# Altium schematic sheet Sheet1.SchDoc
size 431 x 279 mm; SheetNumber: 1; SheetTotal: 1; ENG_APP_DATE: --/--/--; DSN_APP_DATE: --/--/--; CHK_APP_DATE: --/--/--
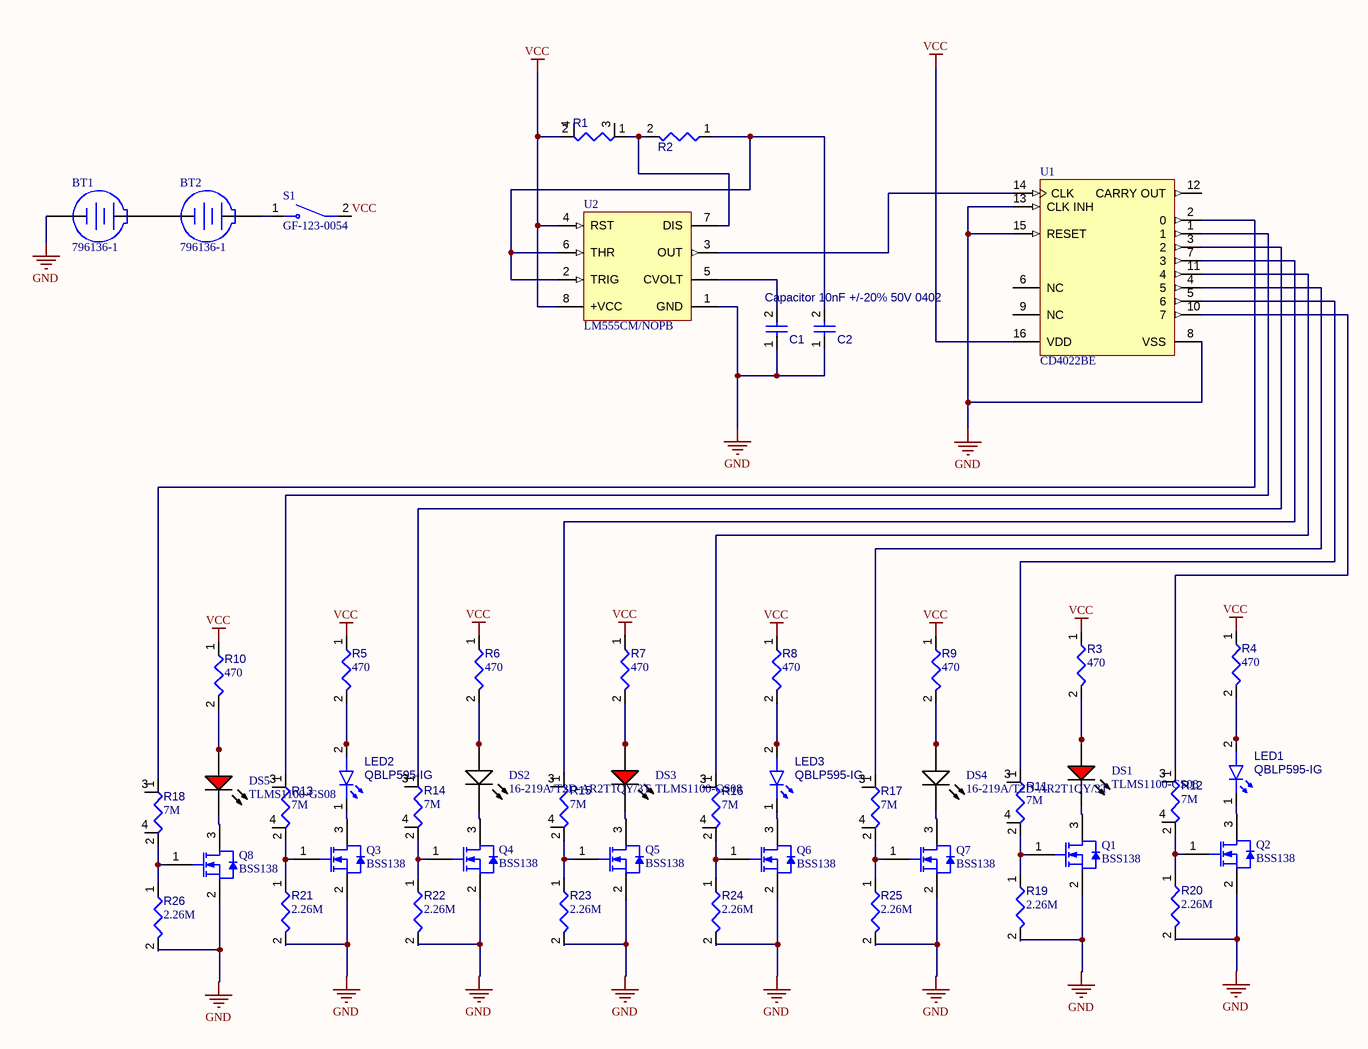
[diagram p0: Sheet1.SchDoc]

## Parts
BT1  796136-1  [TECO-796136-1_V]
BT2  796136-1  [TECO-796136-1_V]
C1  Capacitor 10nF +/-20% 50V 0402  [CAPC0402(1005)60_L]
C2  Capacitor 100 nF +/-10% 50 V 0805  [CAPC2013X95X50LL10T25]  (value not drawn)
DS1  TLMS1100-GS08  [VISH-TLMX1100_V]
DS2  16-219A/T2D-AR2T1QY/3T  [EVRL-0402-2_V]
DS3  TLMS1100-GS08  [VISH-TLMX1100_V]
DS4  16-219A/T2D-AR2T1QY/3T  [EVRL-0402-2_V]
DS5  TLMS1100-GS08  [VISH-TLMX1100_V]
LED1  QBLP595-IG  [QTB-QBLP595_V]
LED2  QBLP595-IG  [QTB-QBLP595_V]
LED3  QBLP595-IG  [QTB-QBLP595_V]
Q1  BSS138  [FAIR-SOT23-3_V]
Q2  BSS138  [FAIR-SOT23-3_V]
Q3  BSS138  [FAIR-SOT23-3_V]
Q4  BSS138  [FAIR-SOT23-3_V]
Q5  BSS138  [FAIR-SOT23-3_V]
Q6  BSS138  [FAIR-SOT23-3_V]
Q7  BSS138  [FAIR-SOT23-3_V]
Q8  BSS138  [FAIR-SOT23-3_V]
R1  KRL3216T4A-M-R007-F-T1  [SUSUMU-3216T4A]  (value not drawn)
R2  Resistor 1M +/-1 % 0402 63 mW  [RESC0402(1005)_L]  (value not drawn)
R3  value 470  [RESC0805(2012)_L]  (hidden comment: Resistor 470R +/-5% 0805 125 mW)
R4  value 470  [RESC0805(2012)_L]  (hidden comment: Resistor 470R +/-5% 0805 125 mW)
R5  value 470  [RESC0805(2012)_L]  (hidden comment: Resistor 470R +/-5% 0805 125 mW)
R6  value 470  [RESC0805(2012)_L]  (hidden comment: Resistor 470R +/-5% 0805 125 mW)
R7  value 470  [RESC0805(2012)_L]  (hidden comment: Resistor 470R +/-5% 0805 125 mW)
R8  value 470  [RESC0805(2012)_L]  (hidden comment: Resistor 470R +/-5% 0805 125 mW)
R9  value 470  [RESC0805(2012)_L]  (hidden comment: Resistor 470R +/-5% 0805 125 mW)
R10  value 470  [RESC0805(2012)_L]  (hidden comment: Resistor 470R +/-5% 0805 125 mW)
R11  value 7M  [SUSUMU-3216T4A]  (hidden comment: KRL3216T4A-M-R007-F-T1)
R12  value 7M  [SUSUMU-3216T4A]  (hidden comment: KRL3216T4A-M-R007-F-T1)
R13  value 7M  [SUSUMU-3216T4A]  (hidden comment: KRL3216T4A-M-R007-F-T1)
R14  value 7M  [SUSUMU-3216T4A]  (hidden comment: KRL3216T4A-M-R007-F-T1)
R15  value 7M  [SUSUMU-3216T4A]  (hidden comment: KRL3216T4A-M-R007-F-T1)
R16  value 7M  [SUSUMU-3216T4A]  (hidden comment: KRL3216T4A-M-R007-F-T1)
R17  value 7M  [SUSUMU-3216T4A]  (hidden comment: KRL3216T4A-M-R007-F-T1)
R18  value 7M  [SUSUMU-3216T4A]  (hidden comment: KRL3216T4A-M-R007-F-T1)
R19  value 2.26M  [RESC0402(1005)_L]  (hidden comment: 2D26MR2F)
R20  value 2.26M  [RESC0402(1005)_L]  (hidden comment: 2D26MR2F)
R21  value 2.26M  [RESC0402(1005)_L]  (hidden comment: 2D26MR2F)
R22  value 2.26M  [RESC0402(1005)_L]  (hidden comment: 2D26MR2F)
R23  value 2.26M  [RESC0402(1005)_L]  (hidden comment: 2D26MR2F)
R24  value 2.26M  [RESC0402(1005)_L]  (hidden comment: 2D26MR2F)
R25  value 2.26M  [RESC0402(1005)_L]  (hidden comment: 2D26MR2F)
R26  value 2.26M  [RESC0402(1005)_L]  (hidden comment: 2D26MR2F)
S1  GF-123-0054  [SW_GF-123-0054]
U1  CD4022BE  [N0016A]
U2  LM555CM/NOPB  [D0008A_M]

## Nets
GND: BT1.2(-) C1.1 C2.1 Q1.2(S) Q2.2(S) Q3.2(S) Q4.2(S) Q5.2(S) Q6.2(S) Q7.2(S) Q8.2(S) R19.2 R20.2 R21.2 R22.2 R23.2 R24.2 R25.2 R26.2 U1.8(VSS) U1.13(CLK_INH) U1.15(RESET) U2.1(GND)
VCC: R1.2(I2) R3.1 R4.1 R5.1 R6.1 R7.1 R8.1 R9.1 R10.1 S1.2 U1.16(VDD) U2.4(RST) U2.8(+VCC)
NetBT1_1: BT1.1(+) BT2.2(-)
NetBT2_1: BT2.1(+) S1.1
NetC1_2: C1.2 U2.5(CVOLT)
NetC2_2: C2.2 R2.1 U2.2(TRIG) U2.6(THR)
NetDS1_1: DS1.1(A) R3.2
NetDS1_2: DS1.2(K) Q1.3(D)
NetDS2_1: DS2.1(A) R6.2
NetDS2_2: DS2.2(K) Q4.3(D)
NetDS3_1: DS3.1(A) R7.2
NetDS3_2: DS3.2(K) Q5.3(D)
NetDS4_1: DS4.1(A) R9.2
NetDS4_2: DS4.2(K) Q7.3(D)
NetDS5_1: DS5.1(A) R10.2
NetDS5_2: DS5.2(K) Q8.3(D)
NetLED1_1: LED1.1(K) Q2.3(D)
NetLED1_2: LED1.2(A) R4.2
NetLED2_1: LED2.1(K) Q3.3(D)
NetLED2_2: LED2.2(A) R5.2
NetLED3_1: LED3.1(K) Q6.3(D)
NetLED3_2: LED3.2(A) R8.2
NetQ1_1: Q1.1(G) R11.2(I2) R19.1
NetQ2_1: Q2.1(G) R12.2(I2) R20.1
NetQ3_1: Q3.1(G) R13.2(I2) R21.1
NetQ4_1: Q4.1(G) R14.2(I2) R22.1
NetQ5_1: Q5.1(G) R15.2(I2) R23.1
NetQ6_1: Q6.1(G) R16.2(I2) R24.1
NetQ7_1: Q7.1(G) R17.2(I2) R25.1
NetQ8_1: Q8.1(G) R18.2(I2) R26.1
NetR1_1: R1.1(I1) R2.2 U2.7(DIS)
NetR11_1: R11.1(I1) U1.5(6)
NetR12_1: R12.1(I1) U1.10(7)
NetR13_1: R13.1(I1) U1.1
NetR14_1: R14.1(I1) U1.3(2)
NetR15_1: R15.1(I1) U1.7(3)
NetR16_1: R16.1(I1) U1.11(4)
NetR17_1: R17.1(I1) U1.4(5)
NetR18_1: R18.1(I1) U1.2(0)
NetU1_14: U1.14(CLK) U2.3(OUT)

Not connected (* = marked no-connect by the designer): R1 3(E1) 4(E2); R11 3(E1) 4(E2); R12 3(E1) 4(E2); R13 3(E1) 4(E2); R14 3(E1) 4(E2); R15 3(E1) 4(E2); R16 3(E1) 4(E2); R17 3(E1) 4(E2); R18 3(E1) 4(E2); U1 6(NC) 9(NC) 12(CARRY_OUT)

## Notes on the sheet
- DWG. NO.
- REV.
- SHT.
- THIS DOCUMENT AND THE DATA DISCLOSED HEREIN OR HEREWITH IS THE PROPERTY OF ALTIUM LIMITED AND MAY BE FREELY DISTRIBUTED IN WHOLE. NO RIGHTS ARE RESERVED OR EXPRESS OR IMPLIED WARANTEE GIVEN.
- REVISION
- DESCRIPTION
- DATE
- APPROVED
- ENG:
- APPROVALS
- PROJECT
- DSN:
- CHK:
- REFERENCE DOCUMENTS
- PROJECT REVISION:
- TITLE
- DOCUMENT REVISION:
- DESIGN ITEM:
- BOM:
- FAB DWG:
- PCB DWG:
- ASSY DWG:
- SCALE:
- SIZE
- B
- CAGE CODE
- FILE NAME
- DWG NO.
- SHEET
- OF
- REV

## Library data of the parts
BT1 BT2 = CMP-002-00002-2: Battery Connector, 1 Cell, CR2032, 2-Pin SMD, RoHS, Tape and Reel; Manufacturer: TE Connectivity; Max Voltage Rating (AC): 30V; Connector Type: BatteryHolder; Batteries: 1; Datasheet URL: http://www.te.com/commerce/DocumentDelivery/DDEController?Action=srchrtrv&DocNm=796136&DocType=Customer+Drawing&DocLang=English&DocFormat=pdf&PartCntxt=796136-1; Contact Plating: Tin; Case/Package: 796136-1; Colour: Black; Package Reference: 796136-1; Package Quantity: 400; Pins: 2; Mounting Technology: SM; RoHS Compliant: True; Datasheet Version: Dec-13; Package Description: 2-Pin Surface Mount Device, Body 32.31 x 19.05 mm; Packaging: TapeandReel; Manufacturer URL: http://www.te.com/; Contact Material: Bronze
C1 = CMP-001-00069-3: Chip Capacitor, 10nF +/-20%, 50V, 0402, Thickness 0.6 mm; Tolerance: 5%; Mounting Technology: SMT; Case/Package: 0402; Pins: 2; Min Operating Temperature: -55°C; Max Operating Temperature: 85°C; Voltage Rating: 50V; Value: 10nF
C2 = CMP-001-00018-6: Chip Capacitor, 100 nF, +/- 10%, 50 V, 0805 (2012 Metric); Capacitor Type: Ceramic; Voltage Rating: 50V; Value: 100nF; Mounting Technology: SM; Case/Package: 0805; Pins: 2; RoHS Compliant: True; Min Operating Temperature: -55°C; Max Operating Temperature: 125°C; Tolerance: 10%
DS1 DS3 DS5 = CMP-007-00030-2: Red Led, 20mA, 2.1 V, -40 to 100 degC, 2-Pin SMD (0603), RoHS, Tape and Reel; Manufacturer: Vishay Semiconductor; Viewing Angle: 160degrees; Forward Voltage: 2.1V; Lens Style: Clear; Power: 90mW; Luminous Intensity: 63mcd; Datasheet Version: Rev. 2.7, 03/2016; Package Quantity: 3000; Colour: Red; Package Description: 2-Pin Surface Mount Device, Body 1.6 x 0.8 mm; Datasheet URL: http://www.vishay.com/docs/83173/tlmb1100.pdf; Package Reference: TLMX1100; Max Operating Temperature: 100°C; Mounting Technology: SM; Packaging: TapeandReel; Case/Package: 0603; Illumination Colour: Red; Forward Current: 20mA; Manufacturer URL: http://www.vishay.com/; RoHS Compliant: True; Min Operating Temperature: -40°C; Nominal Vf: 2.1V; Pins: 2
DS2 DS4 = CMP-007-00000-2: Chip LED, White, 5 V, 10 mA, 30 mW, -40 to 85 degC, 2-Pin SMD (0402), RoHS, Tape and Reel; Manufacturer: Everlight Electronics; Luminous Intensity: 360mcd; Forward Voltage: 2.6V; Viewing Angle: 130degrees; Power: 30mW; Forward Current: 5mA; Package Quantity: 3000; Max Operating Temperature: 85°C; Datasheet Version: Rev. 5, 04/2013; Datasheet URL: http://www.everlight.com/file/ProductFile/16-219A-T2D-AR2T1QY-3T.pdf; Package Reference: 0402; Mounting Technology: SM; Case/Package: 0402; Illumination Colour: White; Manufacturer URL: http://www.everlight.com/; Package Description: 2-Pin Surface Mount Device, Body 1 x 0.5 mm; RoHS Compliant: True; Packaging: TapeandReel; Min Operating Temperature: -40°C
LED1-LED3 = CMP-007-00041-3: Chip LED 0402, Green, 0.02 A, 3.1 to 3.7 V, -40 to 80 degC, 2-Pin SMD, RoHS, Tape and Reel; Case/Package: 0402; Colour: Green; Mounting Technology: SMT; Pins: 2; RoHS Compliant: Yes
Q1-Q8 = CMP-013-00021-4: N-Channel Logic Level Enhancement Mode Field Effect Transistor, 220 mA, 50 V, -55 to 150 degC, 3-Pin SOT-23, RoHS, Tape and Reel; Manufacturer: Fairchild; Elements: 1; Nominal Vgs: 1.3V; Resistance: 0.7Ohm; Typical Rise Time: 9ns; Rds On Max: 3.5Ohm; Nominal Dual Supply Voltage: 50V; Input Capacitance: 27pF; Package Version: Rev. 12, 03/2016; Power: 360mW; Packaging: TapeandReel; Package Description: 3-Pin Small Outline Transistor, Body 2.92 x 1.325 mm, Pitch 0.95 mm; Datasheet URL: https://www.fairchildsemi.com/datasheets/BS/BSS138.pdf; Min Operating Temperature: -55°C; Pins: 3; RoHS Compliant: True; Package Reference: SOT23-3; Package Quantity: 1; Case/Package: TO-236-3; Mounting Technology: SM; Max Operating Temperature: 150°C; Datasheet Version: Rev. C, 10/2005
R1 = CMP-009-00115-2: RES SMD 0.007 OHM 1W 1206 WIDE; Tolerance: 1%; Value: 7M; Mounting Technology: SMT; Case/Package: 1206; Pins: 4; Min Operating Temperature: -55°C; Max Operating Temperature: 155°C
R2 = CMP-009-00165-3: Chip Resistor, 1 MOhms, +/-1 %, 63 mW, -55 to 155 degC, 0402; Tolerance: 1%; Power: 63mW; Case/Package: 0402; Pins: 2; Value: 1M
R3-R10 = CMP-009-00122-3: Chip Resistor, 470 Ohms, +/-5%, 125 mW, -55 to 155 degC, 0805; Tolerance: 5%; Power: 125mW; Max Operating Temperature: 155°C; Case/Package: 0805; Pins: 2; Min Operating Temperature: -55°C
R11-R18 = CMP-009-00115-2: RES SMD 0.007 OHM 1W 1206 WIDE; Tolerance: 1%; Max Operating Temperature: 155°C; Case/Package: 1206; Mounting Technology: SMT; Pins: 4; Min Operating Temperature: -55°C
R19-R26 = CMP-009-00086-2: 2M26 0.063W 1% 0402 (1005 Metric)  SMD; Power: 63mW; Mounting Technology: SMT; Tolerance: 1%; Pins: 2; Case/Package: 0402
S1 = CMP-011-00013-2: Slide Switch SPST Through Hole; Pins: 2; Component Type: Standard; Value: *; Availability: Unavailable; Design Item ID: GF-123-0054; Case/Package: None; Source: GF-123-0054.SchLib; MP: GF-123-0054; Price: None
U1 = CMP-1623-00536-2: CMOS Octal Counter with 8 Decoded Outputs, N0016A, TUBE; Manufacturer: Texas Instruments; Technology Family: CD4000; Output Drive (IOL/IOH)(Max)(mA): 1.5/-1.5; F @ Nom Voltage(Max)(Mhz): 8; ICC @ Nom Voltage(Max)(mA): 0.03; VCC(Min)(V): 3; Voltage(Nom)(V): 5,10,15; Inputs: 1; Bits(#): 10; tpd @ Nom Voltage(Max)(ns): 270; Schmitt Trigger: No; VCC(Max)(V): 18; Rating: Catalog; Output Type: CMOS; Input Type: CMOS; Operating Temperature Range(C): -55 to 125; Function: Counter; Code_JEDEC: MS-001; DatasheetVersion: SCHS027C; Type: Decade; Generic Part Number: CD4022B; PackageReference: N0016A
U2 = CMP-0056-00105-3: Timer, 8-pin Narrow SOIC, Pb-Free; Manufacturer: Texas Instruments; PowerWise: N; CompType: Analog IC; PackageTopMarking: NSZXTT*LM*555CM; PinCount: 8; PackageDescription: SOIC Narrow, 4.9 x 3.9 x 1.45mm, 8 Lead, 1.27mm Pitch; RoHS: Y; ComponentLink1Description: Datasheet URL; ComponentLink1URL: http://www.ti.com/general/docs/lit/getliterature.tsp?genericPartNumber=LM555&fileType=pdf; PackageReference: D0008A; Code_JEDEC: MS-012-AA; Code_IPC: SOIC127P600-8